# Altium schematic sheet Microneedle_Patch_Panel.SchDoc
size Tabloid; SheetNumber: 1; SheetTotal: 1; Sheet_Name: Insert name in Document Parameters; Size: 11x17
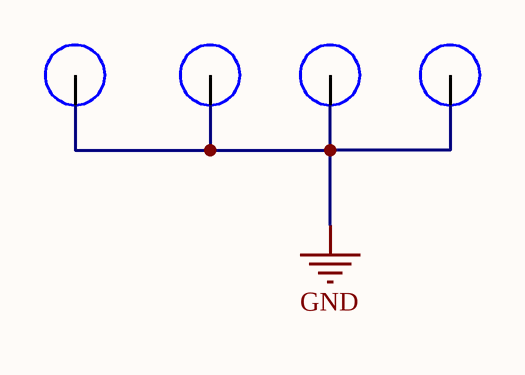
[diagram p0: Microneedle_Patch_Panel.SchDoc]

## Parts
MH1  2 mm  [MH_2MM]  (value not drawn)
MH2  2 mm  [MH_2MM]  (value not drawn)
MH3  2 mm  [MH_2MM]  (value not drawn)
MH4  2 mm  [MH_2MM]  (value not drawn)

## Nets
GND: MH1.1 MH2.1 MH3.1 MH4.1

## Notes on the sheet
- Sheet Name
- Project Title
- Global Project
- Size
- Group
- Revision
- Date
- Sheet
- of
- Filename
- Designers

## Library data of the parts
MH1-MH4 = MH_2MM: Mounting Hole - 2 mm